# EAGLE design BR012_MKL_3310_21MTC_J0_001_01_04 (EAGLE 5.10)
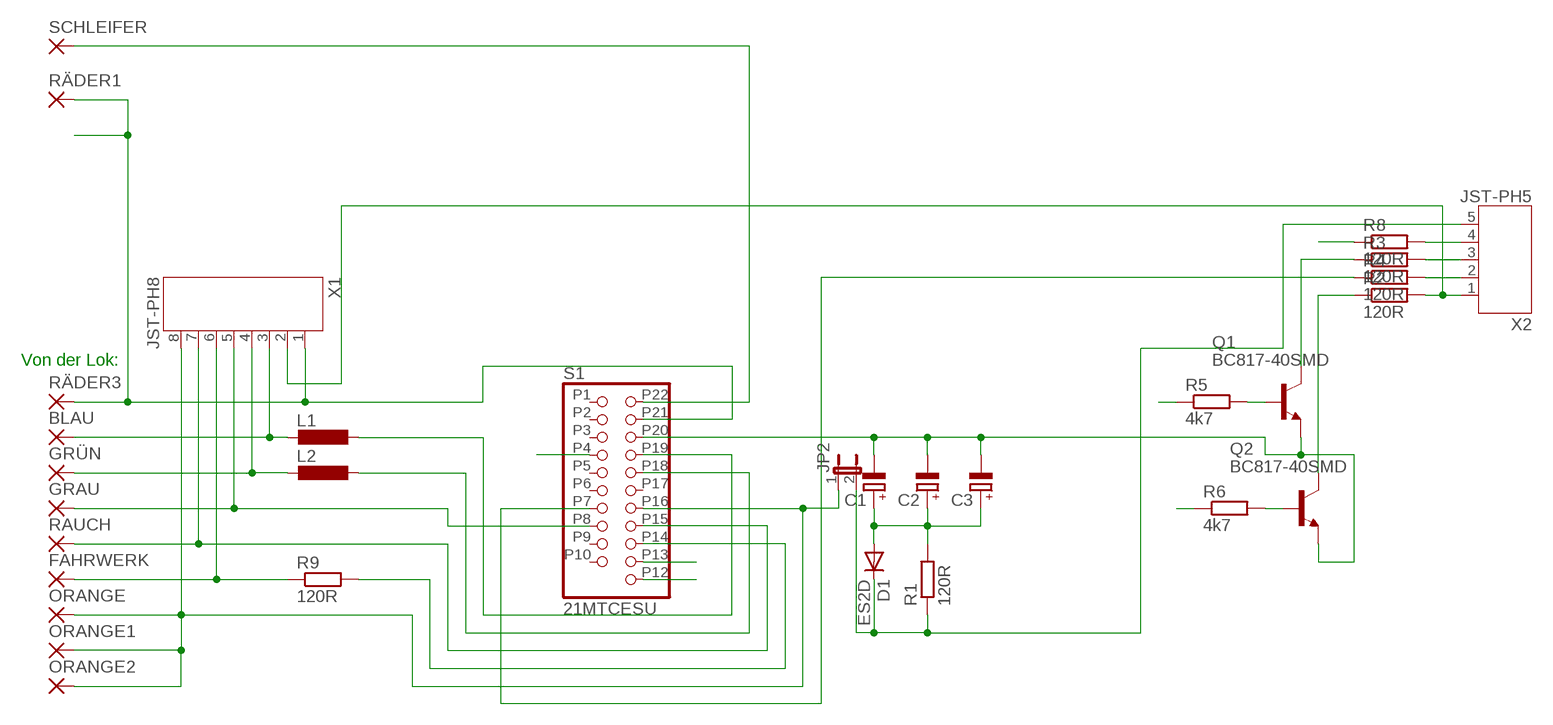
[diagram p0: schematic, sheet 1]

## Parts
BLAU  SMD2  [SMD1,27-2,54]
C1  CPOL-EUE5-13  [E5-13]
C2  CPOL-EUE5-10.5  [E5-10,5]
C3  CPOL-EUE5-10.5  [E5-10,5]
D1  ES2D  [SMB]
FAHRWERK  SMD2  [SMD1,27-2,54]
GRAU  SMD2  [SMD1,27-2,54]
GRÜN  SMD2  [SMD1,27-2,54]
JP2  JP1E2,00  [JP1_2]
L1  L-EUL1212  [L1212]
L2  L-EUL1212  [L1212]
ORANGE  SMD2  [SMD1,27-2,54]
ORANGE1  SMD2  [SMD1,27-2,54]
ORANGE2  SMD2  [SMD1,27-2,54]
Q1  BC817-40SMD  [SOT23-BEC]
Q2  BC817-40SMD  [SOT23-BEC]
R1  120R  R-EU_R0603S  [R0603S]
R2  120R  R-EU_R0603S  [R0603S]
R3  120R  R-EU_R0603S  [R0603S]
R4  120R  R-EU_R0603S  [R0603S]
R5  4k7  R-EU_R0603  [R0603]
R6  4k7  R-EU_R0603  [R0603]
R8  120R  R-EU_R0603S  [R0603S]
R9  120R  R-EU_R0603S  [R0603S]
RAUCH  SMD2  [SMD1,27-2,54]
RÄDER1  SMD2  [SMD1,27-2,54]
RÄDER3  SMD2  [SMD1,27-2,54]
S1  21MTCESU  [21MTC_SMD_ESU]
SCHLEIFER  SMD2  [SMD1,27-2,54]
X1  JST-PH8  [JST-PH8]
X2  JST-PH5  [JST-PH5]

## Nets
AUX3: R2.2 X1.2 X2.1
AUX4: R3.2 X2.3
BLAU: L1.1 S1.P19
F1RAUCH: RAUCH.1(P) S1.P15 X1.7
F2FAHRWERK: R9.2 S1.P14
F3FÜHRER: R6.1 S1.P13
F4KABINE: R5.1 S1.P4
GELB: R4.1 S1.P7
GND: C1.- C2.- C3.- Q1.E Q2.E S1.P20
GRAU: GRAU.1(P) R8.1 S1.P8 X1.5
GRÜN: L2.1 S1.P18
HINTEN: R4.2 X2.2
N$1: C1.+ C2.+ C3.+ D1.A R1.2
N$4: D1.C JP2.2 R1.1 X2.5
N$5: Q2.C R2.1
N$6: Q1.C R3.1
N$7: Q1.B R5.2
N$8: Q2.B R6.2
N$11: R8.2 X2.4
N$12: BLAU.1(P) L1.2 X1.3
N$13: GRÜN.1(P) L2.2 X1.4
N$15: FAHRWERK.1(P) R9.1 X1.6
ORANGE: JP2.1 ORANGE1.1(P) ORANGE2.1(P) ORANGE.1(P) S1.P16 X1.8
RÄDER: RÄDER1.1(P) RÄDER3.1(P) S1.P21 X1.1
SCHLEIFER: S1.P22 SCHLEIFER.1(P)
VCC: S1.P12
Unconnected: S1.P1 S1.P2 S1.P3 S1.P5 S1.P6 S1.P9 S1.P10 S1.P17

## Notes on the sheet
- Von der Lok:

## Library data of the parts
BLAU FAHRWERK GRAU GRÜN ORANGE ORANGE1 ORANGE2 RAUCH RÄDER1 RÄDER3 SCHLEIFER = wirepad:SMD2: SMD PAD
C1-C3 = rcl:CPOL-EU: POLARIZED CAPACITOR, European symbol
D1 = diode:ES2D: DIODE super fast rectifier, 2 A
JP2 = jumper:JP1E: JUMPER
L1 L2 = rcl:L-EU: INDUCTOR, European symbol
Q1 Q2 = transistor-npn:BC817*: NPN Transistor
R1-R6 R8 R9 = rcl:R-EU_: RESISTOR, European symbol
S1 = pinhead:21MTC
X1 = jst-ph:JST-PH8
X2 = jst-ph:JST-PH5

## Board
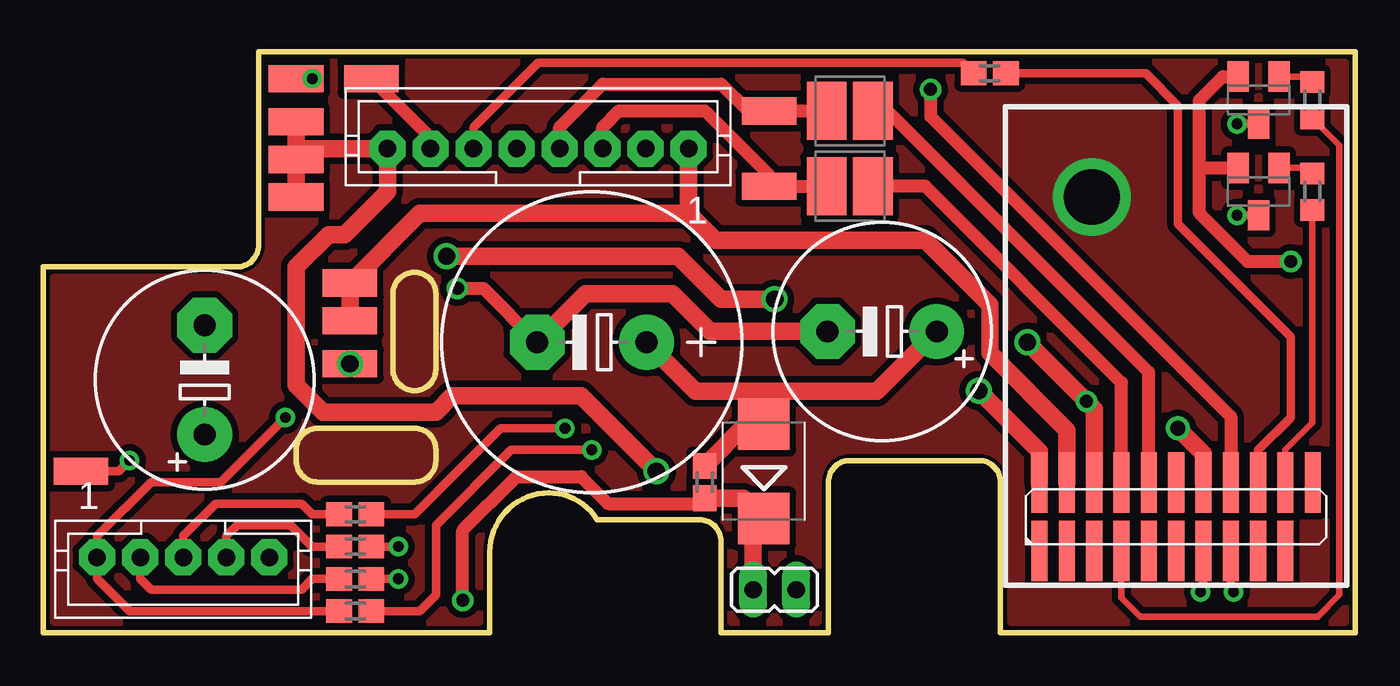
[diagram p1: board, top side]
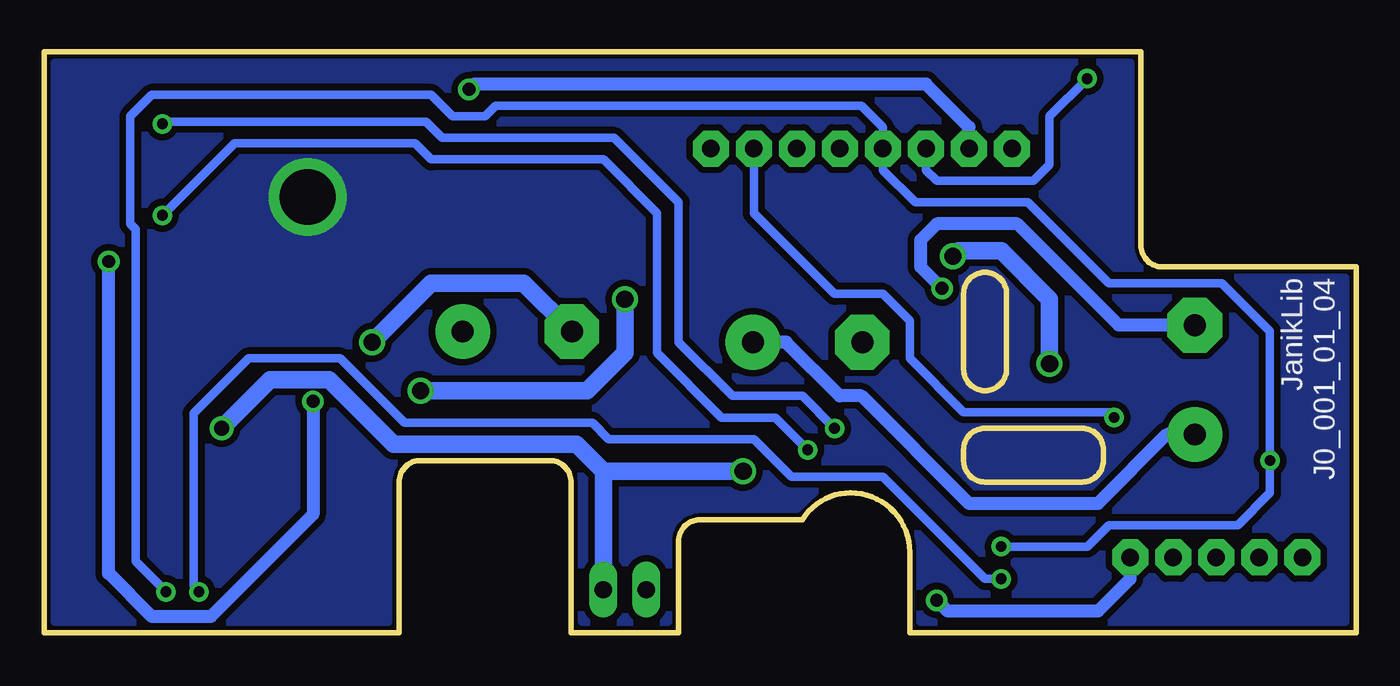
[diagram p2: board, bottom side, seen from below]

No outline drawn. Coordinates in mm, seen from the top.
Copper layers (1*16): Top 0.035mm / dielectric 1.5mm / Bottom 0.035mm
Design rules "default *": minimum track width 10mil, minimum drill 0.6mm, track to track 8mil, track to pad 8mil, pad to pad 8mil, via to via 8mil, smd to smd 8mil, copper to edge 40mil, drill to drill 8mil, minimum pad ring 10mil, minimum via ring 8mil, stop-mask expansion 4mil, vias tented up to drill 0mil, thermal gap 10mil
Milling: 35 lines

### Footprints (pad centres in the part's own frame; a part is rotated, then mirrored left to right if it is on the bottom)
SMD1,27-2,54 = smd 1.27 x 2.54: 1 0,0
E5-13 = drill 1.016 pad 2.54 round: + -2.54,0 | drill 1.016 pad 2.54 octagon: - 2.54,0
E5-10,5 = drill 1.016 pad 2.54 round: + -2.54,0 | drill 1.016 pad 2.54 octagon: - 2.54,0
SMB = smd 2.4 x 2.4: A 2.2,0; C -2.2,0
JP1_2 = drill 0.8 long: 1 0,-1; 2 0,1
L1212 = smd 1.85 x 2.7: 1 -1.075,0; 2 1.075,0
SOT23-BEC = smd 1 x 1.4: B -0.95,-1.1; C 0,1.1; E 0.95,-1.1
R0603S = smd 1.2 x 1.1: 1 -0.75,0; 2 0.75,0
R0603 = smd 1 x 1.1: 1 -0.85,0; 2 0.85,0
21MTC_SMD_ESU = smd 0.75 x 2.8: P1 -6.35,-0.953; P2 -5.08,-0.953; P3 -3.81,-0.953; P4 -2.54,-0.953; P5 -1.27,-0.953; P6 0,-0.953; P7 1.27,-0.953; P8 2.54,-0.953; P9 3.81,-0.953; P10 5.08,-0.953; P12 6.35,2.223; P13 5.08,2.223; P14 3.81,2.223; P15 2.54,2.223; P16 1.27,2.223; P17 0,2.223; P18 -1.27,2.223; P19 -2.54,2.223; P20 -3.81,2.223; P21 -5.08,2.223; P22 -6.35,2.223
JST-PH8 = drill 0.813 pad 1.676 octagon: 1 7,0; 2 5,0; 3 3,0; 4 1,0; 5 -1,0; 6 -3,0; 7 -5,0; 8 -7,0
JST-PH5 = drill 0.813 pad 1.676 octagon: 1 4,0; 2 2,0; 3 0,0; 4 -2,0; 5 -4,0

### Placement (x,y rotation side)
BLAU  33.75,20.75 90 top
C1  25.5,13.5 180 top
C2  39,14 180 top
C3  7.5,11.75 90 top
D1  33.5,7.5 90 top
FAHRWERK  11.75,25.75 270 top
GRAU  1.75,7.5 270 top
GRÜN  33.75,24.25 270 top
JP2  34,2 90 top
L1  37.5,20.75 180 top
L2  37.5,24.25 180 top
ORANGE  11.75,23.75 270 top
ORANGE1  11.75,22 90 top
ORANGE2  11.75,20.25 90 top
Q1  56.5,24.75 180 top
Q2  56.5,20.5 180 top
R1  30.75,7 90 top
R2  14.5,1 180 top
R3  14.5,5.5 180 top
R4  14.5,2.5 180 top
R5  59,24.75 90 top
R6  59,20.5 90 top
R8  14.5,4 180 top
R9  44,26 0 top
RAUCH  15.25,25.75 270 top
RÄDER1  14.25,14.5 90 top
RÄDER3  14.25,16.25 270 top
S1  52.66,4.75 0 top
SCHLEIFER  14.25,12.5 90 top
X1  23,22.5 0 top
X2  6.5,3.5 180 top

### Tracks (layer width: path | path; a pad name or v marks a point on that pad's centre or on a via)
AUX3  (via drill 0.5)
  Top 0.406: R2.2 4,1 2.5,2.5 X2.1 2.5,4.5 5,7 8.25,7 v11.25,10
  Bottom 0.406: X1.2 28,19.5 24.25,15.75 22,15.75 20.75,14.5 20.75,12.75 18.25,10.25 11.5,10.25 v11.25,10
AUX4
  Top 0.406: R3.2 12.5,5.5 12,6 8,6 6.5,4.5 X2.3
BLAU
  Top 0.61: S1.P19 50.12,11.62 41,20.75 L1.1
F1RAUCH  (via drill 0.6)
  Top 0.61: RAUCH.1 18,23 X1.7 | S1.P15 55.2,10.04 41.25,24 v41.25,25.25
  Bottom 0.61: X1.7 18,23.5 20,25.5 41,25.5 v41.25,25.25
F2FAHRWERK
  Top 0.406: R9.2 51.25,26 52.75,24.5 52.75,19 58,13.75 58,10 56.48,8.47 S1.P14
F3FÜHRER
  Top 0.305: S1.P13 57.74,8.49 59,9.75 R6.1
F4KABINE
  Top 0.305: S1.P4 50.12,1.62 51,0.75 59.25,0.75 60.25,1.75 60.25,22.65 R5.1
GELB  (via drill 0.5)
  Top 0.406: S1.P7 53.94,2.03 v53.8,1.9 | R4.1 v16.5,2.5
  Bottom 0.406: v53.8,1.9 54.05,2.15 54.05,10.2 51.5,12.75 47.25,12.75 44.25,9.75 35.5,9.75 34.75,9 28,9 26.25,7.25 22,7.25 17.25,2.5 v16.5,2.5
GND  (via drill 0.6, 0.8)
  Top 0.61: Q1.E 54.85,25.85 53.75,24.75 53.75,21.6 | 53.75,21.6 53.75,19.5 56,17.25 v58,17.25 | 53.75,21.6 Q2.E | v19.25,16 20.46,16 C1.-
  Top 0.813: C2.- 31,14 29.25,15.75 25.21,15.75 C1.- | S1.P20 48.85,10.39 v48.5,10.75 v45.75,13.5
  Bottom 0.61: v58,17.25 58,2.75 56,0.75 53.25,0.75 48.5,5.5 v48.5,10.75 | C3.- 11.04,14.29 15.75,19 19.5,19 20.25,18.25 20.25,17 v19.25,16
  Bottom 0.813: v45.75,13.5 43,16.25 38.71,16.25 C2.-
GRAU  (via drill 0.5)
  Top 0.406: S1.P8 55.2,2.03 v55.34,1.9 | v16.5,4 R8.1 | GRAU.1 3.5,7.5 v4,8
  Bottom 0.406: v16.5,4 12.5,4 11.5,5 5.5,5 4,6.5 v4,8 4,14 6.25,16.25 11.5,16.25 15.25,20 20.5,20 22,21.5 X1.5 22,23.5 23,24.5 40,24.5 40.5,24 42,24 43,25 56,25 57,24 57,19 56.75,18.75 56.75,3.31 v55.34,1.9
GRÜN
  Top 0.61: S1.P18 51.4,12.11 39.25,24.25 L2.1
HINTEN
  Top 0.406: R4.2 12.5,2.5 12,2 5,2 4.5,2.5 X2.2
MASSE  (via drill 2.6)
  other vias: 48.75,20.25
  pour Top (isolate 0.305): 0.5,0.5 0.5,16.5 9,16.5 arc90 10.5,18 10.5,26.5 60.5,26.5 60.5,0.5 45,0.5 45,7 arc90 43.5,8.5 37.5,8.5 arc90 36,7 36,0.5 32,0.5 32,4.25 arc90 30.5,5.75 26,5.75 24.75,7 23.5,7 arc90 20.25,3.75 20.25,0.5
  pour Bottom (isolate 0.305): 0.5,0.5 0.5,16.5 9,16.5 arc90 10.5,18 10.5,26.5 60.5,26.5 60.5,0.5 45,0.5 45,7 arc90 43.5,8.5 37.5,8.5 arc90 36,7 36,0.5 32,0.5 32,4.25 arc90 30.5,5.75 26,5.75 24.75,7 23.5,7 arc90 20.25,3.75 20.25,0.5
N$1
  Top 0.813: C2.+ 38.75,11.21 33.5,11.21 | 33.5,11.21 D1.A 32.7,9.7 R1.2 | 33.5,11.21 30.33,11.21 C1.+
  Bottom 0.61: C3.+ 8.79,9.21 12,6 18,6 23,11 24,11 26.5,13.5 C1.+
N$4  (via drill 0.6)
  Top 0.61: v19.5,1.5 19.5,4.75 22,7.25 25,7.25 26.25,6 30.5,6 R1.1
  Top 0.813: JP2.2 33,4.55 D1.C 32.55,6.25 R1.1
  Bottom 0.61: X2.5 10.5,2.5 12,1 19,1 v19.5,1.5
N$5  (via drill 0.5)
  Top 0.406: v55.5,19.4 Q2.C | v25.5,8.5 21.75,8.5 18.25,5 18.25,1.75 17.5,1 R2.1
  Bottom 0.406: v25.5,8.5 27,10 29.5,10 32.5,13 32.5,19.5 35,22 43,22 43.75,22.75 52.15,22.75 v55.5,19.4
N$6  (via drill 0.5)
  Top 0.406: v55.5,23.65 Q1.C | v24.25,9.5 21.25,9.5 17.25,5.5 R3.1
  Bottom 0.406: v24.25,9.5 25.75,11 29,11 31.5,13.5 31.5,20 34.5,23 42.5,23 43.25,23.75 55.4,23.75 v55.5,23.65
N$7
  Top 0.305: Q1.B 58.75,25.85 R5.2
N$8
  Top 0.305: Q2.B 58.75,21.6 R6.2
N$11
  Top 0.406: R8.2 12.5,4 11.5,5 9,5 8.5,4.5 X2.4
N$12
  Top 0.61: X1.3 26,23.5 26.75,24.25 30.75,24.25 33.75,21.25 BLAU.1 L1.2
N$13
  Top 0.61: X1.4 24,23.5 26,25.5 31.5,25.5 32.75,24.25 GRÜN.1 L2.2
N$15  (via drill 0.5)
  Top 0.406: X1.6 20,23.5 23,26.5 42.75,26.5 R9.1 | v12.5,25.75 FAHRWERK.1
  Bottom 0.406: X1.6 20,21.5 19.5,21 15,21 14.25,21.75 14.25,24 v12.5,25.75
ORANGE  (via drill 0.7, 0.8)
  Top 0.813: S1.P16 53.94,8.31 v52.75,9.5 | v28.5,7.5 25,11 19,11 18.25,10.25 13,10.25 11.75,11.5 11.75,17 13.25,18.5 14,18.5 16,20.5 X1.8 11.75,22.5 | ORANGE2.1 ORANGE1.1 11.75,22.5 | 11.75,22.5 ORANGE.1
  Bottom 0.813: 35,7.5 JP2.1 | v28.5,7.5 35,7.5 | 35,7.5 36.25,8.75 44.75,8.75 47.75,11.75 50.5,11.75 v52.75,9.5
RÄDER
  Top 0.813: S1.P21 47.59,9.41 44,13 44,15.25 41,18.25 31.25,18.25 30,19.5 | 30,19.5 X1.1 | 30,19.5 17.5,19.5 RÄDER3.1 RÄDER1.1
SCHLEIFER  (via drill 0.8)
  Top 0.813: S1.P22 46.31,8.44 v43.5,11.25 | v34,15.5 31.5,15.5 29.5,17.5 v18.75,17.5
  Bottom 0.813: v43.5,11.25 35.75,11.25 34,13 v34,15.5 | v18.75,17.5 18.5,17.75 16.5,17.75 14.25,15.5 SCHLEIFER.1
  other vias: 14.25,12.5

### Text on the board
bNames: J0_001_01_04 | JanikLib
tStop: F2/1 | F2 | 1 | + | BR012 21MTC | F4 | Vo | + | Hi | + | F3 | Vo | + | 1
bStop: design by Janik Merz | JST PH | BR012 21MTC | für Märklin 3310